# EAGLE design driver_32bit_v1.1 (EAGLE 7.4.0)
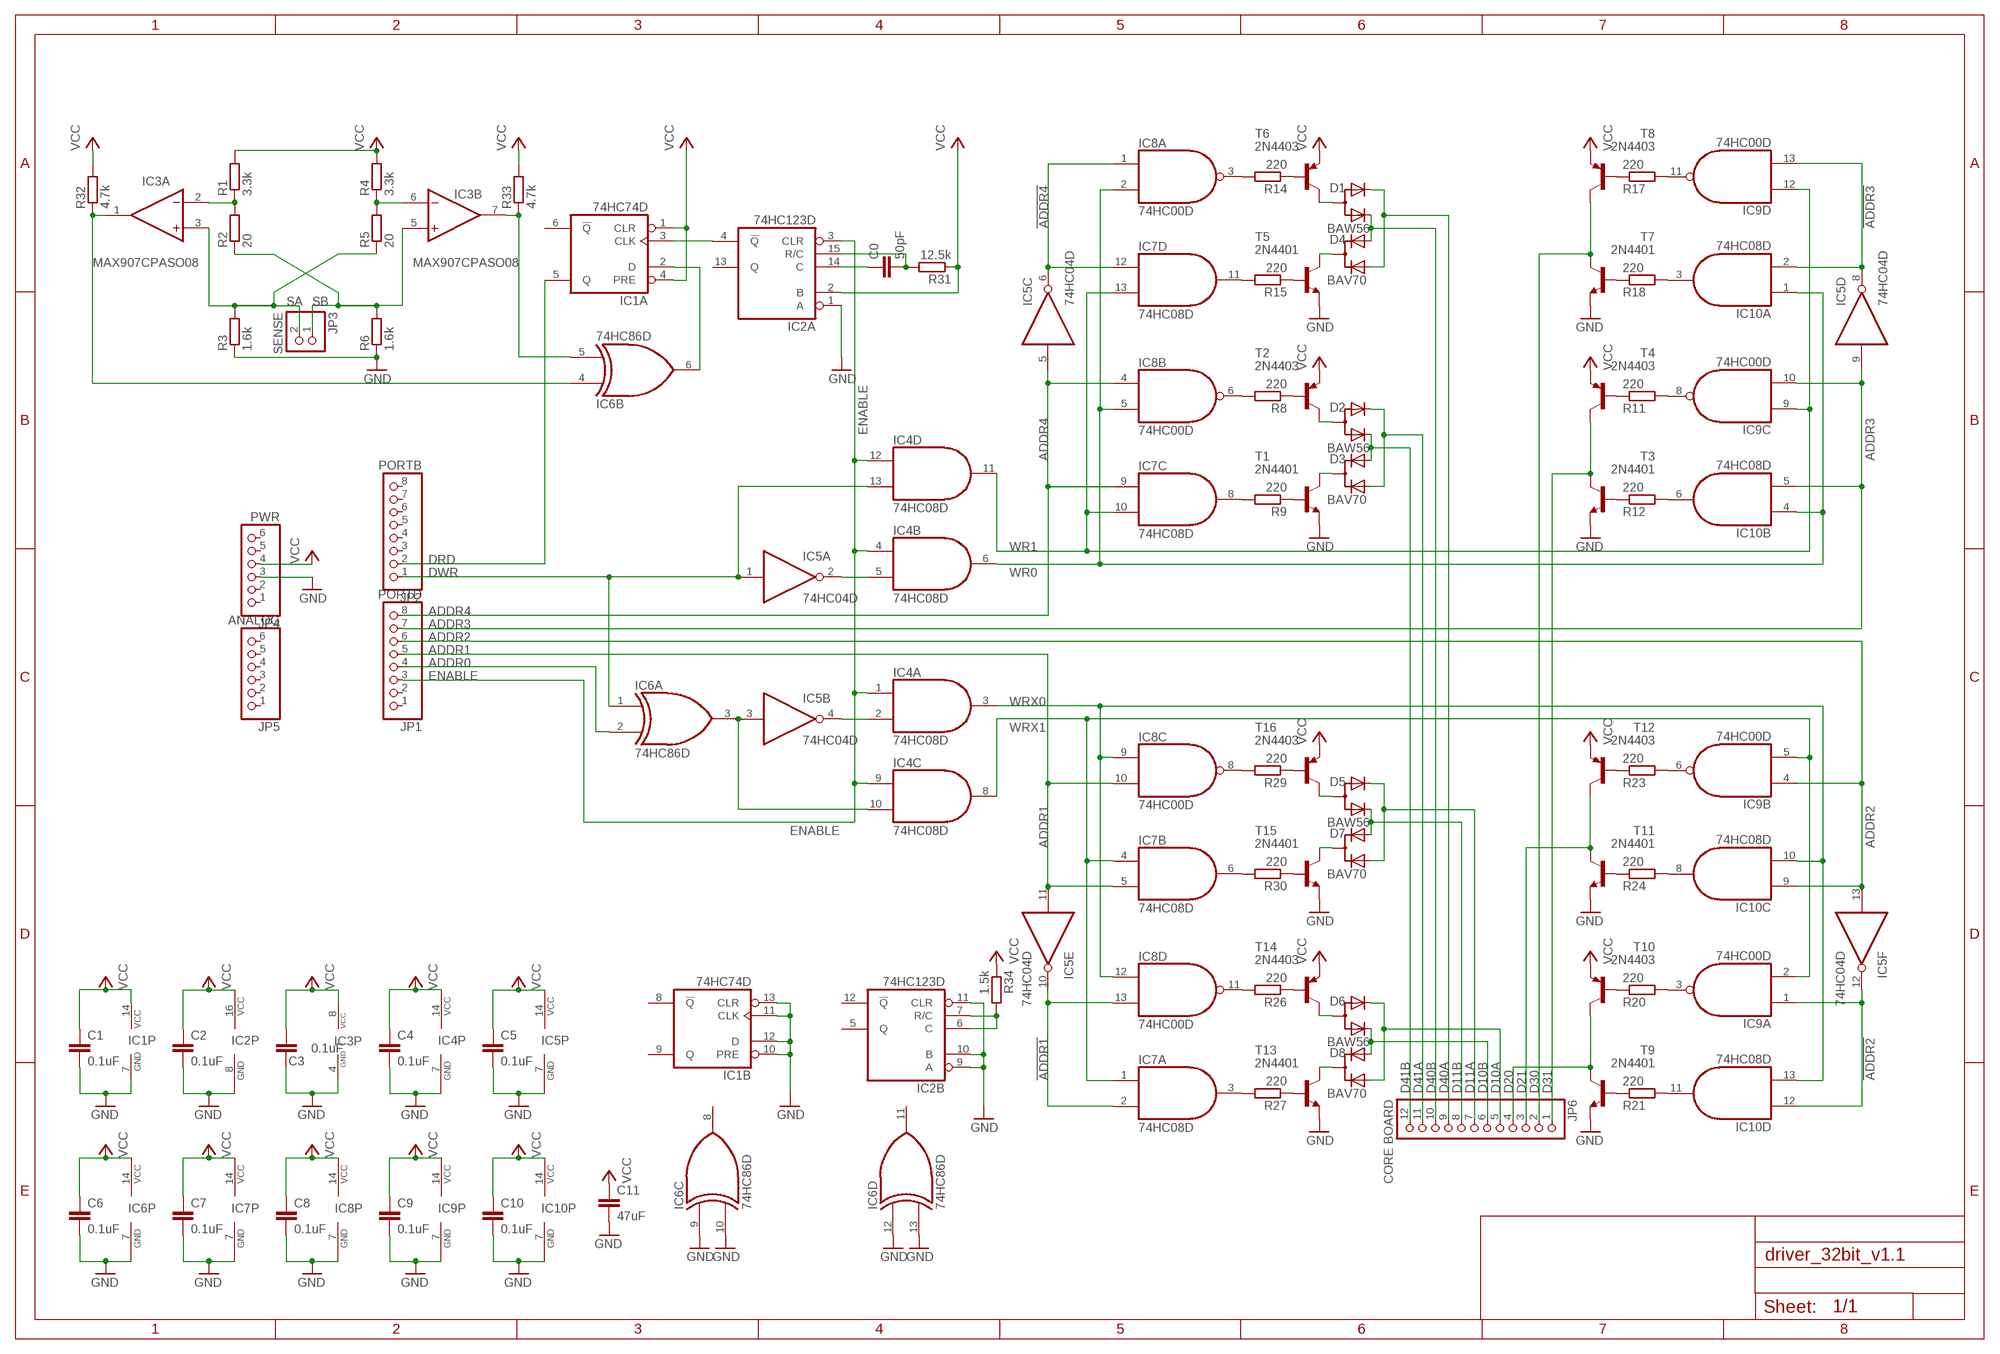
[diagram p0: schematic, sheet 1]

## Parts
C0  50pF  C-EUC1206  [C1206]
C1  0.1uF  C-EUC1206  [C1206]
C2  0.1uF  C-EUC1206  [C1206]
C3  0.1uF  C-EUC1206  [C1206]
C4  0.1uF  C-EUC1206  [C1206]
C5  0.1uF  C-EUC1206  [C1206]
C6  0.1uF  C-EUC1206  [C1206]
C7  0.1uF  C-EUC1206  [C1206]
C8  0.1uF  C-EUC1206  [C1206]
C9  0.1uF  C-EUC1206  [C1206]
C10  0.1uF  C-EUC1206  [C1206]
C11  47uF  C-EUC1206  [C1206]
D1  BAW56  DIODE-2CA|ACSOT23  [SOT23]
D2  BAW56  DIODE-2CA|ACSOT23  [SOT23]
D3  BAV70  DIODE-2AC|CASOT23  [SOT23]
D4  BAV70  DIODE-2AC|CASOT23  [SOT23]
D5  BAW56  DIODE-2CA|ACSOT23  [SOT23]
D6  BAW56  DIODE-2CA|ACSOT23  [SOT23]
D7  BAV70  DIODE-2AC|CASOT23  [SOT23]
D8  BAV70  DIODE-2AC|CASOT23  [SOT23]
IC1  74HC74D  [SO14]
IC2  74HC123D  74123D  [SO16]
IC3  MAX907CPASO08  [SO08]
IC4  74HC08D  74ALS08D  [SO14]
IC5  74HC04D  74ALS04D  [SO14]
IC6  74HC86D  74LS86D  [SO14]
IC7  74HC08D  74ALS08D  [SO14]
IC8  74HC00D  74ALS00D  [SO14]
IC9  74HC00D  74ALS00D  [SO14]
IC10  74HC08D  74ALS08D  [SO14]
JP1  PORTD  PINHD-1X8  [1X08]
JP2  PORTB  PINHD-1X8  [1X08]
JP3  SENSE  PINHD-1X2  [1X02]
JP4  PWR  PINHD-1X6  [1X06]
JP5  ANALOG  PINHD-1X6  [1X06]
JP6  CORE BOARD  PINHD-1X12  [1X12]
R1  3.3k  R-EU_R1206  [R1206]
R2  20  R-EU_R1206  [R1206]
R3  1.6k  R-EU_R1206  [R1206]
R4  3.3k  R-EU_R1206  [R1206]
R5  20  R-EU_R1206  [R1206]
R6  1.6k  R-EU_R1206  [R1206]
R8  220  R-EU_R1206  [R1206]
R9  220  R-EU_R1206  [R1206]
R11  220  R-EU_R1206  [R1206]
R12  220  R-EU_R1206  [R1206]
R14  220  R-EU_R1206  [R1206]
R15  220  R-EU_R1206  [R1206]
R17  220  R-EU_R1206  [R1206]
R18  220  R-EU_R1206  [R1206]
R20  220  R-EU_R1206  [R1206]
R21  220  R-EU_R1206  [R1206]
R23  220  R-EU_R1206  [R1206]
R24  220  R-EU_R1206  [R1206]
R26  220  R-EU_R1206  [R1206]
R27  220  R-EU_R1206  [R1206]
R29  220  R-EU_R1206  [R1206]
R30  220  R-EU_R1206  [R1206]
R31  12.5k  R-EU_R1206  [R1206]
R32  4.7k  R-EU_R1206  [R1206]
R33  4.7k  R-EU_R1206  [R1206]
R34  1.5k  R-EU_R1206  [R1206]
T1  2N4401  MMBT4401LT1-NPN-SOT23-BEC  [SOT23-BEC]
T2  2N4403  MMBT4403LT1-PNP-SOT23-BEC  [SOT23-BEC]
T3  2N4401  MMBT4401LT1-NPN-SOT23-BEC  [SOT23-BEC]
T4  2N4403  MMBT4403LT1-PNP-SOT23-BEC  [SOT23-BEC]
T5  2N4401  MMBT4401LT1-NPN-SOT23-BEC  [SOT23-BEC]
T6  2N4403  MMBT4403LT1-PNP-SOT23-BEC  [SOT23-BEC]
T7  2N4401  MMBT4401LT1-NPN-SOT23-BEC  [SOT23-BEC]
T8  2N4403  MMBT4403LT1-PNP-SOT23-BEC  [SOT23-BEC]
T9  2N4401  MMBT4401LT1-NPN-SOT23-BEC  [SOT23-BEC]
T10  2N4403  MMBT4403LT1-PNP-SOT23-BEC  [SOT23-BEC]
T11  2N4401  MMBT4401LT1-NPN-SOT23-BEC  [SOT23-BEC]
T12  2N4403  MMBT4403LT1-PNP-SOT23-BEC  [SOT23-BEC]
T13  2N4401  MMBT4401LT1-NPN-SOT23-BEC  [SOT23-BEC]
T14  2N4403  MMBT4403LT1-PNP-SOT23-BEC  [SOT23-BEC]
T15  2N4401  MMBT4401LT1-NPN-SOT23-BEC  [SOT23-BEC]
T16  2N4403  MMBT4403LT1-PNP-SOT23-BEC  [SOT23-BEC]

## Nets
!ADDR1: IC5.10(E:O) IC7.2(A:I1) IC8.13(D:I1)
!ADDR2: IC5.12(F:O) IC9.1(A:I0) IC10.12(D:I0)
!ADDR3: IC5.8(D:O) IC9.13(D:I1) IC10.2(A:I1)
!ADDR4: IC5.6(C:O) IC7.12(D:I0) IC8.1(A:I0)
ADDR0: IC6.2(A:I1) JP1.4
ADDR1: IC5.11(E:I) IC7.5(B:I1) IC8.10(C:I1) JP1.5
ADDR2: IC5.13(F:I) IC9.4(B:I0) IC10.9(C:I0) JP1.6
ADDR3: IC5.9(D:I) IC9.10(C:I1) IC10.5(B:I1) JP1.7
ADDR4: IC5.5(C:I) IC7.9(C:I0) IC8.4(B:I0) JP1.8
D10A: D6.1(K2) D8.2(A2) JP6.5
D10B: D6.2(K1) D8.1(A1) JP6.6
D11A: D5.1(K2) D7.2(A2) JP6.7
D11B: D5.2(K1) D7.1(A1) JP6.8
D20: JP6.4 T9.C T10.C
D21: JP6.3 T11.C T12.C
D30: JP6.2 T7.C T8.C
D31: JP6.1 T3.C T4.C
D40A: D1.1(K2) D4.2(A2) JP6.9
D40B: D1.2(K1) D4.1(A1) JP6.10
D41A: D2.1(K2) D3.2(A2) JP6.11
D41B: D2.2(K1) D3.1(A1) JP6.12
DRD: IC1.5(A:Q) JP2.2
DWR: IC4.13(D:I1) IC5.1(A:I) IC6.1(A:I0) JP2.1
ENABLE: IC2.3(A:CLR) IC4.1(A:I0) IC4.4(B:I0) IC4.9(C:I0) IC4.12(D:I0) JP1.3
GND: C1.2 C2.2 C3.1 C4.2 C5.2 C6.2 C7.2 C8.2 C9.2 C10.2 C11.2 IC1.7(P:GND) IC1.10(B:PRE) IC1.11(B:CLK) IC1.12(B:D) IC1.13(B:CLR) IC2.1(A:A) IC2.8(P:GND) IC2.9(B:A) IC2.10(B:B) IC2.11(B:CLR) IC3.4(P:GND) IC4.7(P:GND) IC5.7(P:GND) IC6.7(P:GND) IC6.9(C:I0) IC6.10(C:I1) IC6.12(D:I0) IC6.13(D:I1) IC7.7(P:GND) IC8.7(P:GND) IC9.7(P:GND) IC10.7(P:GND) JP4.3 R3.1 R6.1 T1.E T3.E T5.E T7.E T9.E T11.E T13.E T15.E
N$1: IC3.2(A:-IN) R1.1 R2.2
N$2: IC3.6(B:-IN) R4.1 R5.2
N$3: IC2.6(B:C) IC2.7(B:R/C) R34.2
N$4: D1.3(A) T6.C
N$5: D2.3(A) T2.C
N$6: D5.3(A) T16.C
N$7: R8.1 T2.B
N$8: R9.1 T1.B
N$10: D3.3(C) T1.C
N$11: R11.1 T4.B
N$12: R12.1 T3.B
N$13: IC9.11(D:O) R17.2
N$14: IC10.3(A:O) R18.2
N$15: D4.3(C) T5.C
N$16: D6.3(A) T14.C
N$19: R17.1 T8.B
N$20: R18.1 T7.B
N$22: R14.1 T6.B
N$23: R15.1 T5.B
N$24: IC7.11(D:O) R15.2
N$25: IC8.3(A:O) R14.2
N$26: IC7.8(C:O) R9.2
N$27: IC8.6(B:O) R8.2
N$28: R20.1 T10.B
N$29: R21.1 T9.B
N$31: R23.1 T12.B
N$32: R24.1 T11.B
N$36: IC9.3(A:O) R20.2
N$37: IC1.3(A:CLK) IC2.4(A:!Q)
N$38: IC1.2(A:D) IC6.6(B:O)
N$39: IC3.7(B:OUT) IC6.5(B:I1) R33.1
N$40: IC3.1(A:OUT) IC6.4(B:I0) R32.1
N$41: C0.1 IC2.14(A:C)
N$43: C0.2 IC2.15(A:R/C) R31.2
N$44: IC4.5(B:I1) IC5.2(A:O)
N$46: D7.3(C) T15.C
N$47: D8.3(C) T13.C
N$49: IC10.11(D:O) R21.2
N$51: IC4.2(A:I1) IC5.4(B:O)
N$52: IC4.10(C:I1) IC5.3(B:I) IC6.3(A:O)
N$54: IC9.8(C:O) R11.2
N$55: R26.1 T14.B
N$56: IC10.6(B:O) R12.2
N$58: R27.1 T13.B
N$60: IC9.6(B:O) R23.2
N$61: IC10.8(C:O) R24.2
N$64: R29.1 T16.B
N$65: R30.1 T15.B
N$66: IC7.6(B:O) R30.2
N$67: IC8.8(C:O) R29.2
N$68: IC7.3(A:O) R27.2
N$69: IC8.11(D:O) R26.2
SA: IC3.3(A:+IN) JP3.2 R3.2 R5.1
SB: IC3.5(B:+IN) JP3.1 R2.1 R6.2
VCC: C1.1 C2.1 C3.2 C4.1 C5.1 C6.1 C7.1 C8.1 C9.1 C10.1 C11.1 IC1.1(A:CLR) IC1.4(A:PRE) IC1.14(P:VCC) IC2.2(A:B) IC2.16(P:VCC) IC3.8(P:VCC) IC4.14(P:VCC) IC5.14(P:VCC) IC6.14(P:VCC) IC7.14(P:VCC) IC8.14(P:VCC) IC9.14(P:VCC) IC10.14(P:VCC) JP4.4 R1.2 R4.2 R31.1 R32.2 R33.2 R34.1 T2.E T4.E T6.E T8.E T10.E T12.E T14.E T16.E
WR0: IC4.6(B:O) IC8.2(A:I1) IC8.5(B:I1) IC10.1(A:I0) IC10.4(B:I0)
WR1: IC4.11(D:O) IC7.10(C:I1) IC7.13(D:I1) IC9.9(C:I0) IC9.12(D:I0)
WRX0: IC4.3(A:O) IC8.9(C:I0) IC8.12(D:I0) IC10.10(C:I1) IC10.13(D:I1)
WRX1: IC4.8(C:O) IC7.1(A:I0) IC7.4(B:I0) IC9.2(A:I1) IC9.5(B:I1)
Unconnected: IC1.6(A:!Q) IC1.8(B:!Q) IC1.9(B:Q) IC2.5(B:Q) IC2.12(B:!Q) IC2.13(A:Q) IC6.8(C:O) IC6.11(D:O) JP1.1 JP1.2 JP2.3 JP2.4 JP2.5 JP2.6 JP2.7 JP2.8 JP4.1 JP4.2 JP4.5 JP4.6 JP5.1 JP5.2 JP5.3 JP5.4 JP5.5 JP5.6

## Library data of the parts
C0 C1-C11 = resistor:C-EU: CAPACITOR, European symbol; OC_NEWARK: unknown
D1 D2 D5 D6 = diode:DIODE-2CA|AC: Dual DIODE Cathode-Anode|Anode-Cathode; MPN: BAW56; OC_NEWARK: 87W9075
D3 D4 D7 D8 = diode:DIODE-2AC|CA: Dual DIODE Anode-Cathode|Cathode-Anode; MPN: BAV70; OC_NEWARK: 67T0981
IC1 = 74xx-eu:74*74: Dual D type positive edge triggered FLIP FLOP, preset and clear; MF: TEXAS INSTRUMENTS; MPN: SN74HC74D; OC_NEWARK: 08F6568
IC2 = 74xx-us:74*123: Retriggerable monostable MULTIVIBRATOR; MPN: 74HC123D; OC_NEWARK: 99K0580
IC3 = maxim_alt_MAX907:MAX907CPA: COMPARATOR; OC_NEWARK: unknown
IC4 IC7 IC10 = 74xx-us:74*08: Quad 2-input AND gate; MF: TEXAS INSTRUMENTS; MPN: SN74HC08D; OC_NEWARK: 36K3552
IC5 = 74xx-us:74*04: Hex INVERTER; MF: TEXAS INSTRUMENTS; MPN: SN74HC04D; OC_NEWARK: 72K9430
IC6 = 74xx-us:74*86: Quad 2-input EXCLUSIV-OR (XOR) gate; MPN: 74HC86D; OC_NEWARK: 99K0602
IC8 IC9 = 74xx-us:74*00: Quad 2-input NAND gate; MPN: 74HC00D-Q100,118; OC_NEWARK: 85X2859
JP1 JP2 = pinhead:PINHD-1X8: PIN HEADER; OC_NEWARK: unknown
JP3 = pinhead:PINHD-1X2: PIN HEADER; OC_NEWARK: unknown
JP4 JP5 = pinhead:PINHD-1X6: PIN HEADER; OC_NEWARK: unknown
JP6 = pinhead:PINHD-1X12: PIN HEADER; OC_NEWARK: unknown
R1-R6 R8 R9 R11 R12 R14 R15 R17 R18 R20 R21 R23 R24 R26 R27 R29-R34 = resistor:R-EU_: RESISTOR, European symbol; OC_NEWARK: unknown
T1 T3 T5 T7 T9 T11 T13 T15 = transistor-neu-to92:*-NPN-: NPN Transistror; MF: ON SEMICONDUCTOR; MPN: 2N4401RLRPG; OC_NEWARK: 84K8840
T2 T4 T6 T8 T10 T12 T14 T16 = transistor:*-PNP-: PNP Transistror; OC_NEWARK: unknown

## Board
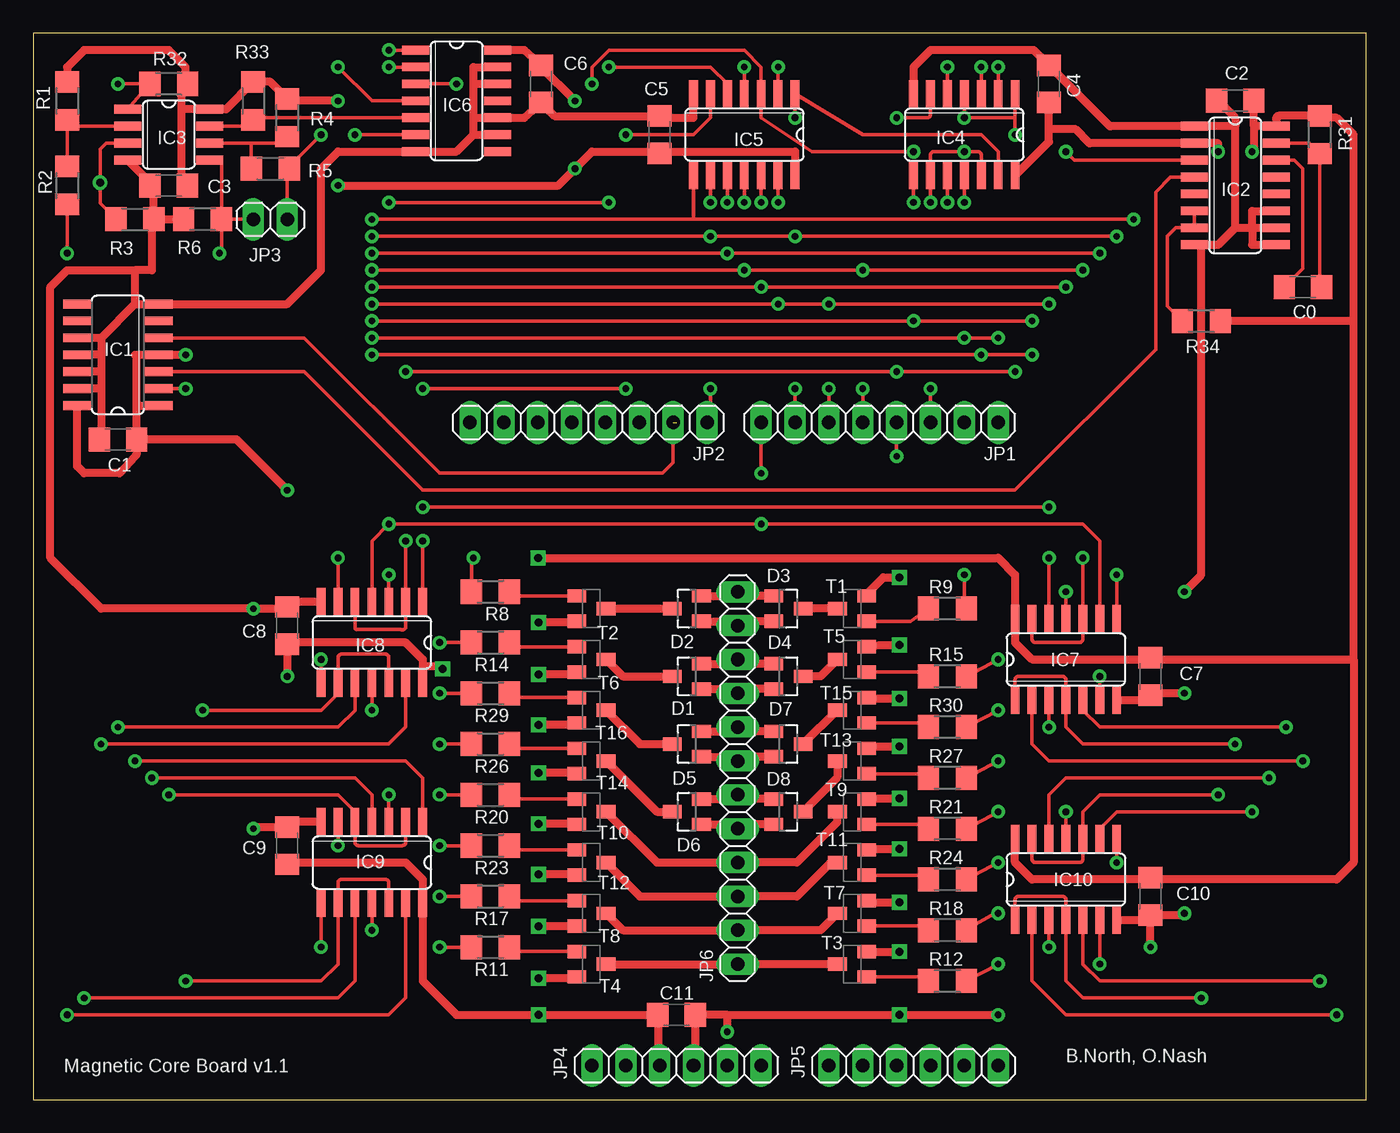
[diagram p1: board, top side]
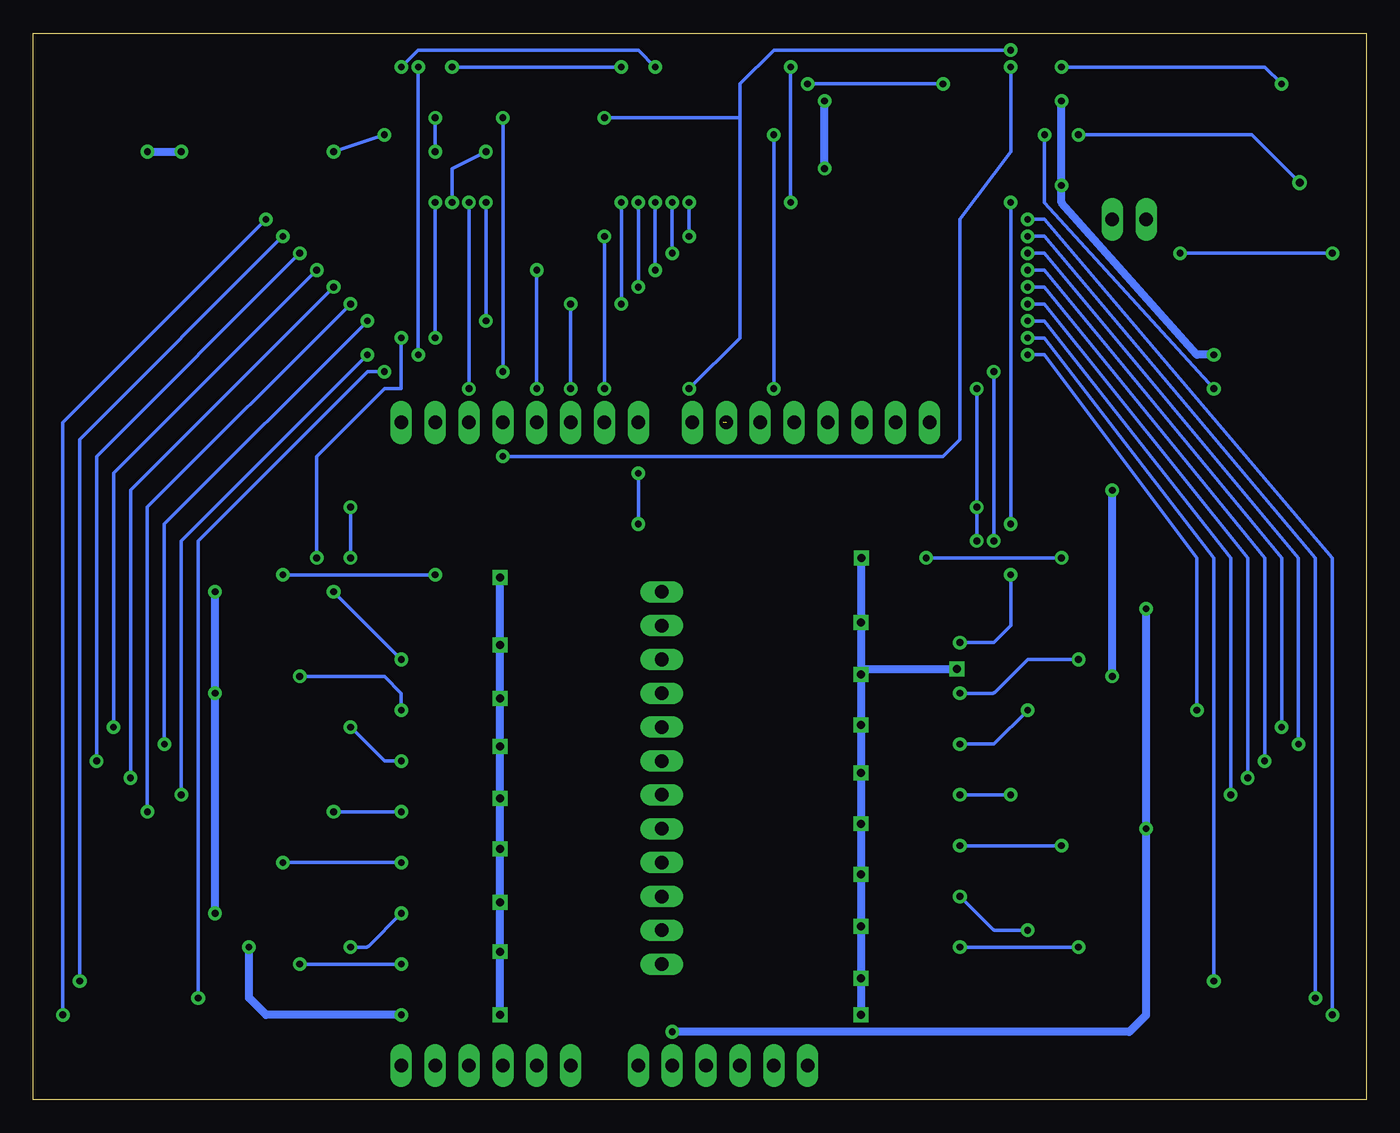
[diagram p2: board, bottom side, seen from below]

Size 100 x 80 mm. Coordinates in mm from the lower left corner, seen from the top.
Outline: 0,0 100,0 100,80 0,80 0,0
Copper layers (1*16): Top 0.035mm / dielectric 1.5mm / Bottom 0.035mm
Design rules "SparkFun *": minimum track width 8mil, minimum drill 20mil, track to track 10mil, track to pad 10mil, pad to pad 10mil, via to via 10mil, smd to smd 10mil, copper to edge 10mil, drill to drill 10mil, minimum pad ring 12mil, minimum via ring 10mil, stop-mask expansion 4mil, vias tented up to drill 25mil, thermal gap 10mil

### Footprints (pad centres in the part's own frame; a part is rotated, then mirrored left to right if it is on the bottom)
C1206 = smd 1.6 x 1.8: 1 -1.4,0; 2 1.4,0
SOT23 = smd 1 x 1.4: 1 -0.95,-1.1; 2 0.95,-1.1; 3 0,1.1
SO14 = smd 0.66 x 2.032: 1 -3.81,-3.073; 2 -2.54,-3.073; 3 -1.27,-3.073; 4 0,-3.073; 5 1.27,-3.073; 6 2.54,-3.073; 7 3.81,-3.073; 8 3.81,3.073; 9 2.54,3.073; 10 1.27,3.073; 11 0,3.073; 12 -1.27,3.073; 13 -2.54,3.073; 14 -3.81,3.073
SO16 = smd 0.66 x 2.032: 1 -4.445,-3.073; 2 -3.175,-3.073; 3 -1.905,-3.073; 4 -0.635,-3.073; 5 0.635,-3.073; 6 1.905,-3.073; 7 3.175,-3.073; 8 4.445,-3.073; 9 4.445,3.073; 10 3.175,3.073; 11 1.905,3.073; 12 0.635,3.073; 13 -0.635,3.073; 14 -1.905,3.073; 15 -3.175,3.073; 16 -4.445,3.073
SO08 = smd 0.66 x 2.032: 1 -1.905,-3.073; 2 -0.635,-3.073; 3 0.635,-3.073; 4 1.905,-3.073; 5 1.905,3.073; 6 0.635,3.073; 7 -0.635,3.073; 8 -1.905,3.073
1X08 = drill 1.016 long: 1 -8.89,0; 2 -6.35,0; 3 -3.81,0; 4 -1.27,0; 5 1.27,0; 6 3.81,0; 7 6.35,0; 8 8.89,0
1X02 = drill 1.016 long: 1 -1.27,0; 2 1.27,0
1X06 = drill 1.016 long: 1 -6.35,0; 2 -3.81,0; 3 -1.27,0; 4 1.27,0; 5 3.81,0; 6 6.35,0
1X12 = drill 1.016 long: 1 -13.97,0; 2 -11.43,0; 3 -8.89,0; 4 -6.35,0; 5 -3.81,0; 6 -1.27,0; 7 1.27,0; 8 3.81,0; 9 6.35,0; 10 8.89,0; 11 11.43,0; 12 13.97,0
R1206 = smd 1.6 x 1.803: 1 -1.422,0; 2 1.422,0
SOT23-BEC = smd 1 x 1.4: B -0.95,-1.1; C 0,1.1; E 0.95,-1.1

### Placement (x,y rotation side)
C0  95.25,60.96 0 top
C1  6.35,49.53 180 top
C2  90.17,74.93 180 top
C3  10.16,68.58 0 top
C4  76.2,76.2 90 top
C5  46.99,72.39 90 top
C6  38.1,76.2 270 top
C7  83.82,31.75 270 top
C8  19.05,35.56 90 top
C9  19.05,19.05 90 top
C10  83.82,15.24 270 top
C11  48.26,6.35 0 top
D1  49.03,31.75 90 top
D2  49.03,36.83 90 top
D3  56.65,36.83 270 top
D4  56.65,31.75 270 top
D5  49.03,26.67 90 top
D6  49.03,21.59 90 top
D7  56.65,26.67 270 top
D8  56.65,21.59 270 top
IC1  6.35,55.88 90 top
IC2  90.17,68.58 270 top
IC3  10.16,72.39 270 top
IC4  69.85,72.39 180 top
IC5  53.34,72.39 180 top
IC6  31.75,74.93 270 top
IC7  77.47,33.02 0 top
IC8  25.4,34.29 180 top
IC9  25.4,17.78 180 top
IC10  77.47,16.51 0 top
JP1  63.5,50.8 180 top
JP2  41.66,50.8 180 top
JP3  17.78,66.04 0 top
JP4  48.26,2.54 180 top
JP5  66.04,2.54 0 top
JP6  52.84,24.13 90 top
R1  2.54,74.93 90 top
R2  2.54,68.58 90 top
R3  7.62,66.04 180 top
R4  19.05,73.66 90 top
R5  17.78,69.85 180 top
R6  12.7,66.04 0 top
R8  34.29,38.1 180 top
R9  68.58,36.83 0 top
R11  34.29,11.43 180 top
R12  68.58,8.89 0 top
R14  34.29,34.29 180 top
R15  68.58,31.75 0 top
R17  34.29,15.24 180 top
R18  68.58,12.7 0 top
R20  34.29,22.86 180 top
R21  68.58,20.32 0 top
R23  34.29,19.05 180 top
R24  68.58,16.51 0 top
R26  34.29,26.67 180 top
R27  68.58,24.13 0 top
R29  34.29,30.48 180 top
R30  68.58,27.94 0 top
R31  96.52,72.39 270 top
R32  10.16,76.2 0 top
R33  16.51,74.93 90 top
R34  87.63,58.42 180 top
T1  61.43,36.83 90 top
T2  41.87,36.83 270 top
T3  61.43,10.16 90 top
T4  41.87,10.16 270 top
T5  61.43,33.02 90 top
T6  41.87,33.02 270 top
T7  61.43,13.97 90 top
T8  41.87,13.97 270 top
T9  61.43,21.59 90 top
T10  41.87,21.59 270 top
T11  61.43,17.78 90 top
T12  41.87,17.78 270 top
T13  61.43,25.4 90 top
T14  41.87,25.4 270 top
T15  61.43,29.21 90 top
T16  41.87,29.21 270 top

### Tracks (layer width: path | path; a pad name or v marks a point on that pad's centre or on a via)
!ADDR1  (via drill 0.51)
  Top 0.254: IC8.13 27.94,27.94 26.67,26.67 v5.08,26.67 | v52.07,67.31 IC5.10 | IC7.2 74.93,26.67 76.2,25.4 v95.25,25.4 | v80.01,63.5 v52.07,63.5 v25.4,63.5
  Bottom 0.254: v52.07,63.5 v52.07,67.31 | v95.25,25.4 95.25,48.26 v80.01,63.5 | v5.08,26.67 5.08,40.64 24.13,63.5 v25.4,63.5
!ADDR2  (via drill 0.51)
  Top 0.254: IC9.1 29.21,24.13 27.94,25.4 v7.62,25.4 | v54.61,67.31 IC5.12 | IC10.12 76.2,22.86 77.47,24.13 v92.71,24.13 | v77.47,60.96 v54.61,60.96 v25.4,60.96
  Bottom 0.254: v54.61,60.96 v54.61,67.31 | v92.71,24.13 92.71,41.7 92.71,41.91 92.71,45.72 v77.47,60.96 | v7.62,25.4 7.62,40.64 24.13,60.96 v25.4,60.96
!ADDR3  (via drill 0.51)
  Top 0.254: IC9.13 27.94,7.62 26.67,6.35 v2.54,6.35 | IC10.2 74.93,8.89 77.47,6.35 v97.79,6.35 | 49.53,66.04 v82.55,66.04 | 49.53,66.04 IC5.8 | v25.4,66.04 49.53,66.04
  Bottom 0.254: v2.54,6.35 2.54,40.64 24.13,66.04 v25.4,66.04 | v97.79,6.35 97.79,50.8 v82.55,66.04
!ADDR4  (via drill 0.51)
  Top 0.254: IC5.6 50.8,73.66 49.53,72.39 v44.45,72.39 | v76.2,40.64 IC7.12 | IC8.1 v29.21,41.91 | v29.21,44.45 v76.2,44.45 | v29.21,53.34 v44.45,53.34
  Bottom 0.254: v76.2,44.45 v76.2,40.64 | v44.45,53.34 v44.45,72.39 | v29.21,44.45 v29.21,41.91 v29.21,44.45 | v29.21,44.45 v29.21,53.34
ADDR0  (via drill 0.51)
  Top 0.254: v64.77,48.26 JP1.4 | v26.67,77.47 IC6.2
  Bottom 0.254: v64.77,48.26 31.75,48.26 30.48,49.53 30.48,66.04 26.67,71.12 v26.67,77.47
ADDR1  (via drill 0.51)
  Top 0.254: IC8.10 24.13,29.21 22.86,27.94 v6.35,27.94 | v53.34,67.31 IC5.11 | v93.98,27.94 80.01,27.94 78.74,29.21 IC7.5 | v78.74,62.23 v62.23,62.23 v53.34,62.23 v25.4,62.23 | v62.23,53.34 JP1.5
  Bottom 0.254: v53.34,62.23 v53.34,67.31 | v93.98,27.94 93.98,41.4 93.98,41.91 93.98,46.99 v78.74,62.23 | v6.35,27.94 6.35,40.64 24.13,62.23 v25.4,62.23 | v62.23,62.23 v62.23,53.34
ADDR2  (via drill 0.51)
  Top 0.254: IC9.4 25.4,22.86 24.13,24.13 v8.89,24.13 | v55.88,67.31 IC5.13 | v91.44,21.59 81.28,21.59 80.01,20.32 IC10.9 | v25.4,59.69 v55.88,59.69 v59.69,59.69 v76.2,59.69 | v59.69,53.34 JP1.6
  Bottom 0.254: v55.88,59.69 v55.88,67.31 | v91.44,21.59 91.44,44.45 v76.2,59.69 | v8.89,24.13 8.89,40.64 24.13,59.69 v25.4,59.69 | v59.69,59.69 v59.69,53.34
ADDR3  (via drill 0.51)
  Top 0.254: IC9.10 24.13,8.89 22.86,7.62 v3.81,7.62 | v50.8,67.31 IC5.9 | v96.52,8.89 80.01,8.89 78.74,10.16 IC10.5 | v25.4,64.77 v50.8,64.77 v57.15,64.77 v81.28,64.77 | v57.15,53.34 JP1.7
  Bottom 0.254: v50.8,64.77 v50.8,67.31 | v96.52,8.89 96.52,49.53 v81.28,64.77 | v3.81,7.62 3.81,40.64 24.13,64.77 v25.4,64.77 | v57.15,64.77 v57.15,53.34
ADDR4  (via drill 0.51)
  Top 0.254: IC7.9 80.01,41.91 78.74,43.18 v54.61,43.18 v26.67,43.18 25.4,41.91 IC8.4 | v54.61,46.99 JP1.8 | v26.67,67.31 v43.18,67.31 | v43.18,77.47 50.8,77.47 52.07,76.2 IC5.5
  Bottom 0.254: v26.67,43.18 v26.67,67.31 | v54.61,43.18 v54.61,46.99 | v43.18,67.31 v43.18,77.47
D10A
  Top 0.61: D6.1 52.52,20.64 JP6.5 53.16,20.64 D8.2
D10B
  Top 0.61: D8.1 53.16,22.54 JP6.6 52.52,22.54 D6.2
D11A
  Top 0.61: D7.2 53.16,25.72 JP6.7 52.52,25.72 D5.1
D11B
  Top 0.61: D5.2 52.52,27.62 JP6.8 53.16,27.62 D7.1
D20
  Top 0.61: T10.C 46.78,17.78 JP6.4 57.28,17.78 60.3,20.8 60.3,21.56 T9.C
D21
  Top 0.61: T12.C 45.51,15.24 JP6.3 57.29,15.24 59.83,17.78 T11.C
D30
  Top 0.61: T8.C 44.24,12.7 JP6.2 59.06,12.7 T7.C
D31
  Top 0.61: T4.C JP6.1 T3.C
D40A
  Top 0.61: D1.1 52.52,30.8 JP6.9 53.16,30.8 D4.2
D40B
  Top 0.61: D1.2 52.52,32.7 JP6.10 53.16,32.7 D4.1
D41A
  Top 0.61: D3.2 53.16,35.88 JP6.11 52.52,35.88 D2.1
D41B
  Top 0.61: D2.2 52.52,37.78 JP6.12 53.16,37.78 D3.1
DRD  (1 unrouted)
  Top 0.254: IC1.5 20.32,57.15 30.48,46.99 44.45,46.99 44.46,47 47.2,47 48.01,47.81 JP2.2
DWR  (via drill 0.51)
  Top 0.254: IC4.13 72.39,71.12 71.12,72.39 62.23,72.39 IC5.1 v57.15,73.66 | v50.8,53.34 50.8,50.8 JP2.1 | v26.67,78.74 IC6.1
  Bottom 0.254: v50.8,53.34 46.99,57.15 46.99,73.66 | 46.99,73.66 46.99,76.2 44.45,78.74 v26.67,78.74 | 46.99,73.66 v57.15,73.66
ENABLE  (via drill 0.51)
  Top 0.254: 73.66,73.66 IC4.1 | 73.66,73.66 v69.85,73.66 IC4.4 | IC4.12 71.12,70.87 arc90 70.87,71.12 v69.85,71.12 67.56,71.12 arc90 67.31,70.87 IC4.9 v67.31,67.31 | JP1.3 v67.31,53.34 | 73.66,73.66 v73.66,72.39 | IC2.3 78.11,70.48 v77.47,71.12
  Bottom 0.254: v69.85,71.12 v69.85,73.66 | v67.31,53.34 v67.31,67.31 | v73.66,72.39 v77.47,71.12
GND  (via drill 0.51, 0.6)
  Top 0.254: C5.2 46.99,73.66 | C9.2 19.05,20.85 | 19.05,37.36 C8.2 19.05,36.83 | C10.2 83.82,13.44 | 83.82,29.95 C7.2 83.82,30.48 | v16.51,20.32 16.51,20.45 | 86.36,13.84 v86.36,13.97 | 49.66,2.54 JP4.3 | C1.2 5.08,49.53 | 87.63,64.14 IC2.8 | 88.9,74.93 C2.2 | 8.76,68.81 C3.1 9.04,68.58 | 8.89,66.04 R3.1
  Top 0.61: 46.99,73.66 49.53,73.66 IC5.7 | 19.05,20.85 IC9.7 | 19.05,37.36 IC8.7 | 83.82,13.44 IC10.7 | 83.82,29.95 IC7.7 | 19.05,36.83 v16.51,36.83 5.08,36.83 1.27,40.64 1.27,60.96 2.54,62.23 7.62,62.23 | 16.51,20.45 C9.2 | v86.36,30.48 83.82,30.48 | 86.36,13.84 C10.2 v83.82,11.43 | 52.07,6.35 v64.98,6.35 v72.39,6.35 | 49.66,2.54 C11.2 52.07,6.35 | 7.62,59.69 5.08,57.15 | 7.62,59.69 IC1.7 19.05,59.69 21.59,62.23 21.59,69.85 22.86,71.12 IC6.7 31.75,71.12 33.02,72.39 | 91.44,65.41 91.44,64.14 IC2.9 | 91.44,65.41 IC2.10 | 90.17,65.41 91.44,65.41 | 91.44,65.41 91.44,66.67 IC2.11 | 90.17,65.41 90.17,73.03 | 88.9,74.93 90.17,73.66 90.17,73.03 | 90.17,73.03 IC2.1 80.78,73.03 C4.2 75.06,78.74 73.66,78.74 72.5,78.74 67.31,78.74 66.04,77.47 IC4.7 | 7.62,62.23 7.62,59.69 | v52.07,5.08 52.07,6.35 | C5.2 39.11,73.79 C6.2 36.83,73.66 IC6.10 33.02,73.66 | 87.63,64.14 87.63,39.37 v86.36,38.1 | IC2.8 88.9,64.14 90.17,65.41 | 33.02,72.39 33.02,73.66 | 33.02,73.66 33.02,76.2 | 33.02,76.2 33.02,77.47 IC6.13 | 33.02,76.2 IC6.12 | 33.02,72.39 IC6.9 | 9.04,68.58 R3.1 R6.1 | 8.76,68.81 IC3.4 | 5.08,57.15 5.08,55.88 | 5.08,55.88 5.08,54.61 | 5.08,54.61 5.08,53.34 | 5.08,53.34 5.08,49.66 C1.2 | 5.08,57.15 IC1.10 | 5.08,55.88 IC1.11 | 5.08,54.61 IC1.12 | 5.08,53.34 IC1.13 | T1.E 62.53,37.93 63.77,39.17 v64.98,39.17 | T5.E 63.46,34.1 v64.98,34.1 | T15.E 62.53,30.1 v64.98,30.1 | T13.E 62.53,26.5 v64.98,26.5 | T9.E 62.53,22.6 v64.98,22.6 | T11.E 62.53,18.8 v64.98,18.8 | T7.E 62.53,14.8 v64.98,14.8 | T3.E v64.98,11.1 | 8.89,66.04 8.89,62.23 7.62,62.23
  Bottom 0.61: v16.51,36.83 v16.51,20.32 16.51,6.35 17.78,5.08 v52.07,5.08 | v86.36,13.97 v86.36,30.48 v86.36,38.1 | v72.39,6.35 82.55,6.35 83.82,7.62 v83.82,11.43 | v64.98,6.35 v64.98,11.1 v64.98,14.8 v64.98,18.8 v64.98,22.6 v64.98,26.5 v64.98,30.1 v64.98,34.1 v64.98,39.17
N$1
  Top 0.254: R2.2 R1.1 2.54,73.03 IC3.2
N$2
  Top 0.254: 19.05,72.39 R4.1 19.05,71.75 16.51,71.75 | IC3.6 16.51,71.75 | R5.2 16.36,71.75 16.51,71.75
N$3
  Top 0.254: IC2.6 IC2.7 85.72,65.41 85.09,64.77 85.09,59.54 R34.2
N$4
  Top 0.61: T6.C 44.24,31.75 D1.3
N$5
  Top 0.61: T2.C D2.3
N$6
  Top 0.61: T16.C 45.51,26.67 D5.3
N$7
  Top 0.254: T2.B 36.03,37.78 R8.1
N$8
  Top 0.254: T1.B 65.81,35.88 R9.1
N$10
  Top 0.61: T1.C D3.3
N$11
  Top 0.254: T4.B 36.03,11.11 R11.1
N$12
  Top 0.254: T3.B 66.84,9.21 R12.1
N$13  (via drill 0.51)
  Top 0.254: IC9.11 v25.4,12.7 | v30.48,15.24 R17.2
  Bottom 0.254: v25.4,12.7 27.84,12.7 arc45 28.01,12.77 v30.48,15.24
N$14  (via drill 0.51)
  Top 0.254: v76.2,11.43 IC10.3 | v72.39,13.97 72.39,14.12 70.15,12.85 R18.2
  Bottom 0.254: v76.2,11.43 75.03,11.43 arc-45 74.86,11.5 v72.39,13.97
N$15
  Top 0.61: T5.C 59.06,31.75 D4.3
N$16
  Top 0.61: T14.C 46.78,21.59 D6.3
N$19
  Top 0.254: T8.B 36.03,14.92 R17.1
N$20
  Top 0.254: T7.B 66.84,13.02 R18.1
N$22
  Top 0.254: T6.B 36.03,33.97 R14.1
N$23
  Top 0.254: T5.B 66.84,32.07 R15.1
N$24  (via drill 0.51)
  Top 0.254: v77.47,38.1 IC7.11 | R15.2 v72.39,33.02
  Bottom 0.254: v72.39,33.02 v77.47,38.1
N$25  (via drill 0.51)
  Top 0.254: IC8.3 v26.67,39.37 | v30.48,34.29 R14.2
  Bottom 0.254: v26.67,39.37 26.67,35.56 27.94,34.29 v30.48,34.29
N$26  (via drill 0.51)
  Top 0.254: v81.28,39.37 IC7.8 | R9.2 69.85,36.83 v69.85,39.37
  Bottom 0.254: v69.85,39.37 v81.28,39.37
N$27  (via drill 0.51)
  Top 0.254: IC8.6 v22.86,40.64 | R8.2 32.87,40.49 v33.02,40.64
  Bottom 0.254: v22.86,40.64 v33.02,40.64
N$28
  Top 0.254: T10.B 36.03,22.54 R20.1
N$29
  Top 0.254: T9.B 66.84,20.64 R21.1
N$31
  Top 0.254: T12.B 36.03,18.73 R23.1
N$32
  Top 0.254: T11.B 66.84,16.83 R24.1
N$36  (via drill 0.51)
  Top 0.254: IC9.3 v26.67,22.86 | v30.48,22.86 R20.2
  Bottom 0.254: v26.67,22.86 v30.48,22.86
N$37
  Top 0.254: IC1.3 20.32,54.61 29.21,45.72 73.66,45.72 84.2,56.26 84.2,68.1 85.31,69.22 IC2.4
N$38  (via drill 0.51)
  Top 0.254: v24.13,72.39 IC6.6 | IC1.2 v11.43,53.34
  Bottom 0.254: v24.13,72.39 24.13,67.31 v11.43,53.34
N$39
  Top 0.254: IC3.7 16.51,73.03 R33.1 16.66,73.66 IC6.5
N$40  (via drill 0.51)
  Top 0.254: IC3.1 R32.1 v6.35,76.2 | IC6.4 25.4,74.93 v22.86,77.47
  Bottom 0.254: v6.35,76.2 7.62,77.47 v22.86,77.47
N$41
  Top 0.254: IC2.14 94.61,70.48 95.25,69.85 95.25,62.36 C0.1
N$43
  Top 0.254: C0.2 96.52,61.09 R31.2 95.73,71.75 IC2.15
N$44  (via drill 0.51)
  Top 0.254: v68.58,77.47 IC4.5 | IC5.2 v55.88,77.47
  Bottom 0.254: v55.88,77.47 v68.58,77.47
N$46
  Top 0.61: T15.C 60.29,29.21 D7.3
N$47
  Top 0.61: T13.C 60.33,24.17 D8.3
N$49  (via drill 0.51)
  Top 0.254: v77.47,21.59 IC10.11 | R21.2 v72.39,21.59
  Bottom 0.254: v72.39,21.59 v77.47,21.59
N$51  (via drill 0.51)
  Top 0.254: v72.39,77.47 IC4.2 | IC5.4 v53.34,77.47
  Bottom 0.254: v53.34,77.47 54.61,78.74 71.12,78.74 v72.39,77.47
N$52  (via drill 0.51)
  Top 0.254: v68.58,67.31 IC4.10 | v66.04,71.12 58.42,71.12 54.61,73.66 54.61,74.93 | 54.61,74.93 IC5.3 | IC6.3 v31.75,76.2 | v41.91,76.2 41.91,77.47 43.18,78.74 53.34,78.74 54.61,77.47 54.61,74.93
  Bottom 0.254: v68.58,67.31 68.58,69.85 v66.04,71.12 | v31.75,76.2 v41.91,76.2
N$54  (via drill 0.51)
  Top 0.254: v21.59,11.43 IC9.8 | v30.48,11.43 R11.2
  Bottom 0.254: v21.59,11.43 v30.48,11.43
N$55
  Top 0.254: T14.B 36.03,26.35 R26.1
N$56  (via drill 0.51)
  Top 0.254: v80.01,10.16 IC10.6 | R12.2 v72.39,10.16
  Bottom 0.254: v72.39,10.16 v80.01,10.16
N$58
  Top 0.254: T13.B 66.84,24.45 R27.1
N$60  (via drill 0.51)
  Top 0.254: v22.86,19.05 IC9.6 | v30.48,19.05 R23.2
  Bottom 0.254: v22.86,19.05 v30.48,19.05
N$61  (via drill 0.51)
  Top 0.254: v81.28,17.78 IC10.8 | R24.2 v72.39,17.78
  Bottom 0.254: v72.39,17.78 v81.28,17.78
N$64
  Top 0.254: T16.B 36.03,30.16 R29.1
N$65
  Top 0.254: T15.B 66.84,28.26 R30.1
N$66  (via drill 0.51)
  Top 0.254: v80.01,31.75 IC7.6 | R30.2 v72.39,29.21
  Bottom 0.254: v72.39,29.21 72.39,30.48 73.66,31.75 v80.01,31.75
N$67  (via drill 0.51)
  Top 0.254: IC8.8 v21.59,33.02 | v30.48,30.48 R29.2
  Bottom 0.254: v30.48,30.48 28.05,30.48 arc-45 27.87,30.55 25.4,33.02 v21.59,33.02
N$68  (via drill 0.51)
  Top 0.254: v76.2,27.94 IC7.3 | R27.2 v72.39,25.4
  Bottom 0.254: v72.39,25.4 73.66,25.4 v76.2,27.94
N$69  (via drill 0.51)
  Top 0.254: v25.4,29.21 IC8.11 | 30.33,26.67 v30.48,26.67 R26.2
  Bottom 0.254: v30.48,26.67 27.94,26.67 v25.4,29.21
SA  (via drill 0.51, 0.6)
  Top 0.254: 19.05,69.85 JP3.2 | 19.05,69.85 R5.1 | v21.59,72.39 19.05,69.85 | 6.35,66.19 R3.2 5,67.24 v5,68.8 5,69.8 5,71.3 5.46,71.75 IC3.3
  Bottom 0.254: v21.59,72.39 8.59,72.39 v5,68.8
SB  (via drill 0.51)
  Top 0.254: IC3.5 14.12,70.48 R6.2 | R6.2 JP3.1 | v2.54,63.5 R2.1 2.54,67.31 | v13.97,63.5 14.12,63.5 R6.2
  Bottom 0.254: v2.54,63.5 v13.97,63.5
VCC  (via drill 0.51, 0.6)
  Top 0.254: 46.99,71.12 C5.1 46.86,71.12 | C9.1 19.05,17.78 | 19.05,34.29 C8.1 | C7.1 83.82,33.02 74.93,33.02 | 46.86,2.54 JP4.4 | 11.18,74.3 11.08,75.53 | 91.57,71.12 v91.44,71.12 | C4.1 76.7,74.3 | IC10.14 73.66,20.32 | 83.82,16.51 C10.1 | 96.67,73.66 R31.1
  Top 0.61: 19.05,17.78 27.94,17.78 29.21,16.51 IC9.14 29.21,8.89 31.75,6.35 v37.9,6.35 C11.1 46.86,2.54 | IC10.14 73.66,17.78 74.93,16.51 83.82,16.51 97.79,16.51 99.06,17.78 99.06,33.02 | 91.57,73.03 C2.1 | 91.57,73.03 IC2.16 93.24,73.56 arc-90 93.5,73.81 R31.1 | IC6.14 36.83,78.74 C6.1 38.1,77.47 v40.64,74.93 | C3.2 11.1,68.58 11.1,70.2 11.08,75.53 R32.2 11.43,76.35 11.43,77.47 10.16,78.74 3.81,78.74 2.54,77.47 R1.2 | 11.18,74.3 IC3.8 14.45,74.3 R33.2 17.78,76.35 R4.2 19.2,74.93 v22.86,74.93 | 91.57,73.03 91.57,71.12 | 29.21,32.5 29.21,33.02 27.94,34.29 19.05,34.29 v19.05,31.75 | 29.21,32.5 IC8.14 | v19.05,45.72 15.24,49.53 C1.1 | v37.86,40.64 72.39,40.64 73.66,39.37 IC7.14 73.66,34.29 74.93,33.02 99.06,33.02 | 46.86,71.12 41.91,71.12 v40.64,69.85 39.37,68.58 v22.86,68.58 | 99.06,33.02 99.06,58.42 | 99.06,58.42 99.06,72.39 97.79,73.66 96.67,73.66 | v11.43,55.88 IC1.4 7.62,55.88 7.75,55.75 7.75,52.07 | 46.99,71.12 57.15,71.12 IC5.14 | v88.9,71.12 88.9,71.75 IC2.2 79.25,71.75 78.2,72.8 76.2,72.8 | IC1.14 3.28,47.52 3.81,46.99 6.48,46.99 7.62,48.26 7.75,48.39 C1.1 | C1.1 7.75,52.07 | 7.75,52.07 IC1.1 | 99.06,58.42 R34.1 | T2.E 40.69,35.8 v37.9,35.8 | T6.E 40.6,31.9 v37.9,31.9 | T16.E 40.61,28.1 v37.9,28.1 | T14.E 40.72,24.5 v37.9,24.5 | T10.E 40.71,20.7 v37.9,20.7 | T12.E 40.7,16.9 v37.9,16.9 | T8.E 40.75,13 v37.9,13 | T4.E 40.66,9.1 v37.9,9.1 | v30.7,32.3 30.5,32.5 29.21,32.5 | IC4.14 76.2,71.86 76.2,72.8 | 76.2,72.8 C4.1
  Bottom 0.61: v91.44,71.12 v88.9,71.12 | v19.05,31.75 v19.05,45.72 | v40.64,69.85 v40.64,74.93 | v11.43,55.88 12.7,55.88 22.86,67.31 v22.86,68.58 v22.86,74.93 | v37.86,40.64 37.9,40.6 v37.9,35.8 v37.9,31.9 | v37.9,31.9 v37.9,28.1 v37.9,24.5 v37.9,20.7 v37.9,16.9 v37.9,13 v37.9,9.1 v37.9,6.35 | v37.9,31.9 37.5,32.3 v30.7,32.3
WR0  (via drill 0.51)
  Top 0.254: IC8.5 24.13,35.41 arc90 24.28,35.26 27.59,35.26 arc90 27.94,35.41 IC8.2 v27.94,41.91 | v64.77,73.66 67.06,73.66 arc90 67.31,73.91 IC4.6 | v87.63,7.62 78.74,7.62 77.47,8.89 IC10.4 77.47,14.99 arc90 77.22,15.24 73.91,15.24 arc90 73.66,14.99 IC10.1 | v27.94,54.61 v64.77,54.61 v73.66,54.61
  Bottom 0.254: v64.77,54.61 v64.77,73.66 | v87.63,7.62 87.63,41.91 74.93,54.61 v73.66,54.61 | v27.94,41.91 v27.94,54.61
WR1  (via drill 0.51)
  Top 0.254: IC7.13 74.93,34.54 arc90 75.18,34.29 78.49,34.29 arc90 78.74,34.54 IC7.10 v78.74,40.64 | v11.43,8.89 21.59,8.89 22.86,10.16 IC9.9 22.86,16.26 arc-90 23.11,16.51 26.42,16.51 arc-90 26.67,16.26 IC9.12 | v69.85,67.31 IC4.11 | v72.39,57.15 v69.85,57.15 v25.4,57.15
  Bottom 0.254: v69.85,57.15 v69.85,67.31 | v72.39,57.15 72.39,53.34 73.66,53.34 78.74,48.26 v78.74,40.64 | v11.43,8.89 11.43,40.64 24.13,57.15 v25.4,57.15
WRX0  (via drill 0.51)
  Top 0.254: IC8.12 26.67,33.17 arc90 26.42,33.42 23.11,33.42 arc90 22.86,33.07 IC8.9 22.86,30.48 21.59,29.21 v12.7,29.21 | IC10.13 74.93,18.03 arc90 75.18,17.78 78.49,17.78 arc90 78.74,18.03 IC10.10 78.74,21.59 80.01,22.86 v88.9,22.86 | v71.12,77.47 IC4.3 | v74.93,55.88 v71.12,55.88 v25.4,55.88
  Bottom 0.254: v71.12,55.88 v71.12,77.47 | v88.9,22.86 88.9,41.2 88.9,41.91 v74.93,55.88 | v12.7,29.21 12.7,40.64 24.13,55.88 v25.4,55.88
WRX1  (via drill 0.51)
  Top 0.254: IC9.2 27.94,19.3 arc-90 27.69,19.05 24.38,19.05 arc-90 24.13,19.3 IC9.5 24.13,21.59 22.86,22.86 v10.16,22.86 | IC7.1 73.66,31.5 arc-90 73.91,31.75 77.22,31.75 arc-90 77.47,31.5 IC7.4 77.47,27.94 78.74,26.67 v90.17,26.67 | v66.04,67.31 IC4.8 | v66.04,58.42 62.23,58.42 | v66.04,58.42 v74.93,58.42 | v25.4,58.42 v66.04,58.42
  Bottom 0.254: v66.04,58.42 v66.04,67.31 | v90.17,26.67 90.17,43.18 v74.93,58.42 | v10.16,22.86 10.16,40.64 24.13,58.42 v25.4,58.42

### Text on the board
tPlace: B.North, O.Nash | Magnetic Core Board v1.1